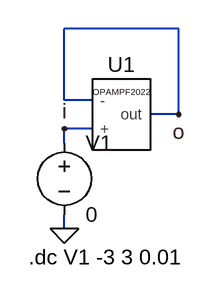
[diagram p0: schematic opamp_commonmode.asc]
opamp_commonmode.asc, the LTspice schematic file:
Version 4
SHEET 1 880 680
WIRE 240 48 112 48
WIRE 112 128 112 48
WIRE 144 128 112 128
WIRE 240 144 240 48
WIRE 240 144 208 144
WIRE 144 160 112 160
WIRE 112 176 112 160
WIRE 112 272 112 256
FLAG 112 272 0
FLAG 240 144 o
FLAG 112 160 i
SYMBOL voltage 112 160 R0
WINDOW 123 0 0 Left 0
WINDOW 39 0 0 Left 0
SYMATTR InstName V1
SYMATTR Value 0
SYMBOL OPAMPF2022 176 144 R0
SYMATTR InstName U1
TEXT 72 304 Left 2 !.dc V1 -3 3 0.01

The netlist it stands for:
* opamp_commonmode.asc
V1 i 0 0
XU1 i o o OPAMPF2022  ; pins + - out
.dc V1 -3 3 0.01
.lib C:\Users\ricig\Desktop\Lavoro\LTspice\schematics\FULL2024.cir
.backanno
.end